# EAGLE design Debug (EAGLE 9.4.2)
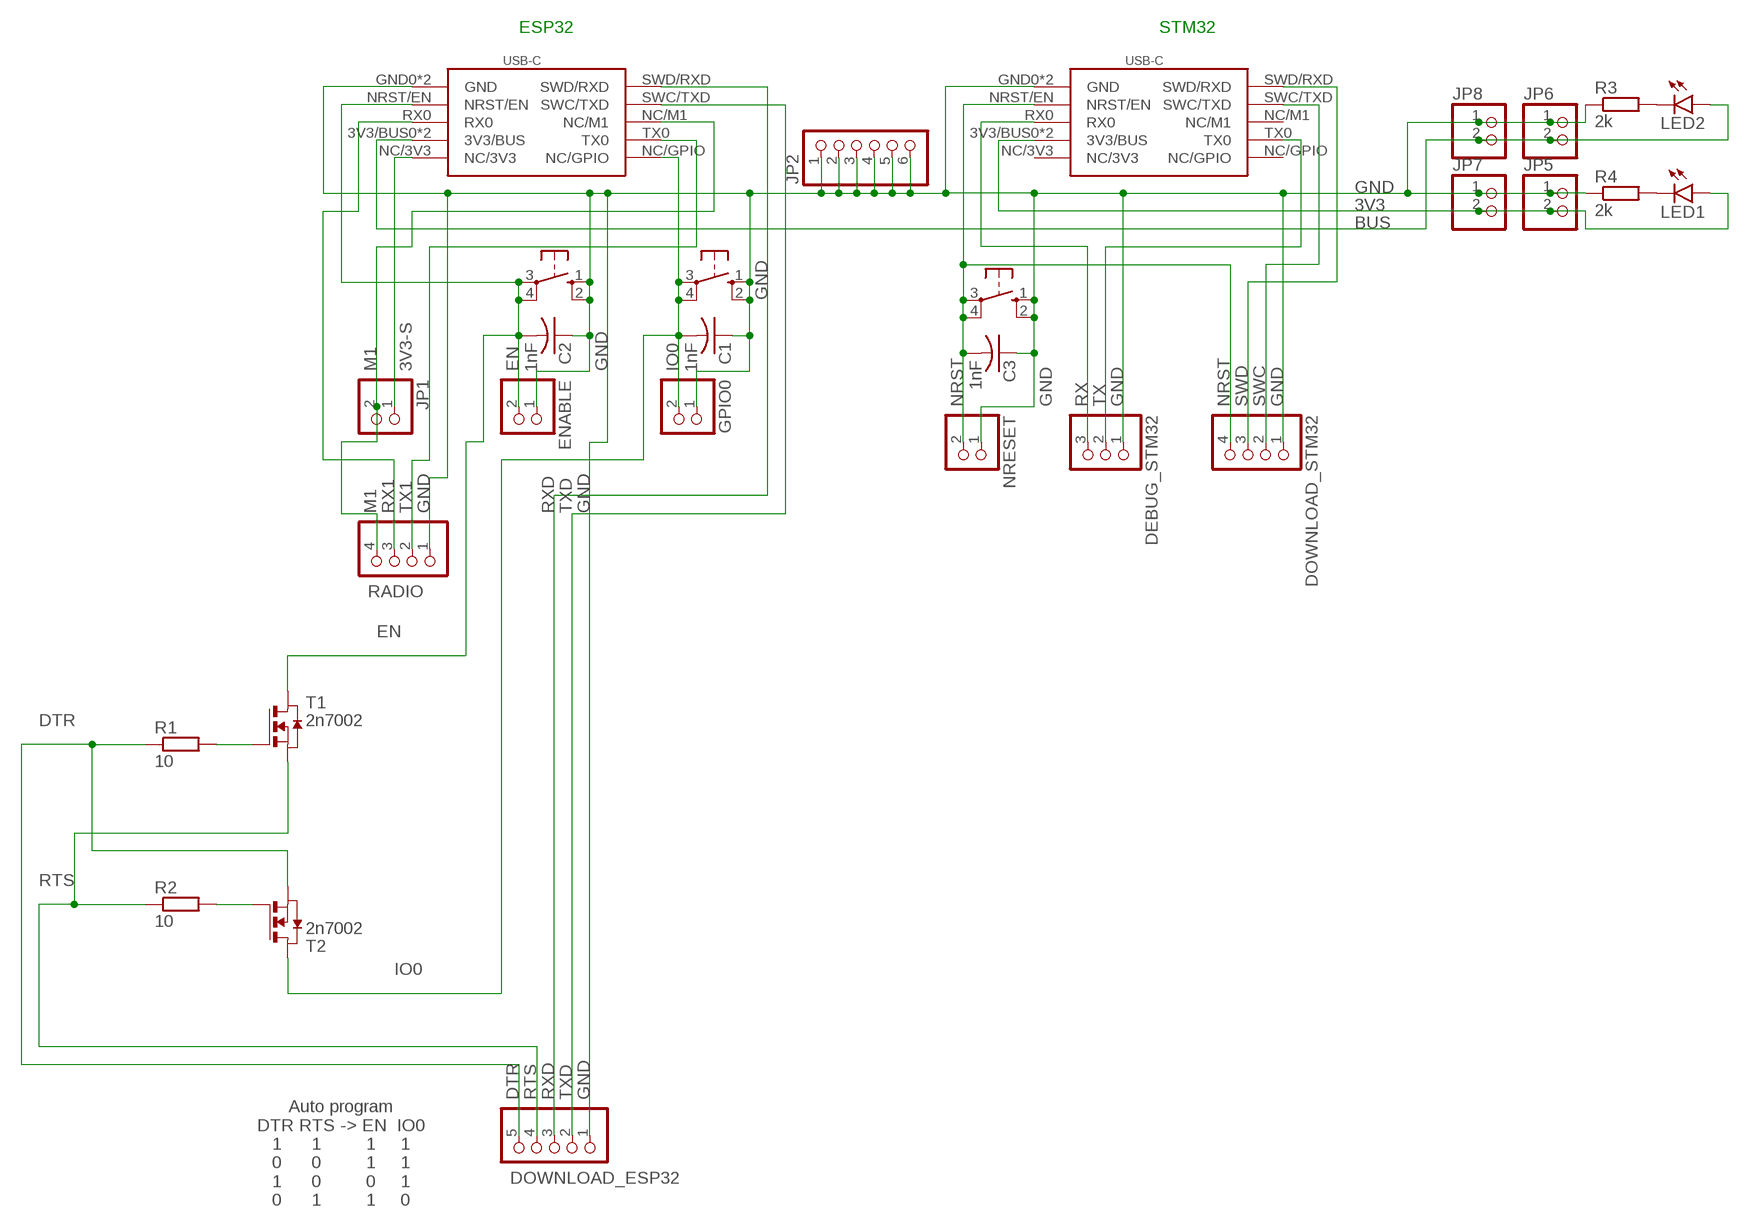
[diagram p0: schematic, sheet 1]

## Parts
C1  1nF  C-USC0603  [C0603]
C2  1nF  C-USC0603  [C0603]
C3  1nF  C-USC0603  [C0603]
DEBUG_STM32  PINHD-1X3  [1X03]
DOWNLOAD_ESP32  PINHD-1X5  [1X05]
DOWNLOAD_STM32  PINHD-1X4  [1X04]
EN  10-XX  [B3F-10XX]
ENABLE  PINHD-1X2  [1X02]
GPIO0  PINHD-1X2  [1X02]
IO0  10-XX  [B3F-10XX]
JP1  PINHD-1X2  [1X02]
JP2  PINHD-1X6  [1X06]
JP5  PINHD-1X2  [1X02]
JP6  PINHD-1X2  [1X02]
JP7  PINHD-1X2  [1X02]
JP8  PINHD-1X2  [1X02]
LED1  LEDCHIPLED_0603  [CHIPLED_0603]
LED2  LEDCHIPLED_0603  [CHIPLED_0603]
NRESET  PINHD-1X2  [1X02]
NRST  10-XX  [B3F-10XX]
R1  10  R-EU_R0603  [R0603]
R2  10  R-EU_R0603  [R0603]
R3  2k  R-EU_R0603  [R0603]
R4  2k  R-EU_R0603  [R0603]
RADIO  PINHD-1X4  [1X04]
T1  2n7002  NMOSSOT23  [SOT-23]
T2  2n7002  NMOSSOT23  [SOT-23]
U$1  USB-C  [USB-C]
U$2  USB-C  [USB-C]

## Nets
3V3: JP5.2 JP7.2 LED1.A U$2.3V3/BUS0(3V3/BUS) U$2.3V3/BUS1(3V3/BUS)
3V3-S: JP1.1 U$1.NC/3V3
BUS: JP6.2 JP8.2 LED2.A U$1.3V3/BUS0(3V3/BUS) U$1.3V3/BUS1(3V3/BUS)
DTR: DOWNLOAD_ESP32.5 R1.1 T2.2(S)
EN: C2.2 EN.3(P) EN.4(P1) ENABLE.2 T1.1(D) U$1.NRST/EN
GND: C1.1 C2.1 C3.1 DEBUG_STM32.1 DOWNLOAD_ESP32.1 DOWNLOAD_STM32.1 EN.1(S) EN.2(S1) ENABLE.1 GPIO0.1 IO0.1(S) IO0.2(S1) JP2.1 JP2.2 JP2.3 JP2.4 JP2.5 JP2.6 JP5.1 JP6.1 JP7.1 JP8.1 NRESET.1 NRST.1(S) NRST.2(S1) R3.1 R4.1 RADIO.1 U$1.GND0(GND) U$1.GND1(GND) U$2.GND0(GND) U$2.GND1(GND)
IO0: C1.2 GPIO0.2 IO0.3(P) IO0.4(P1) T2.1(D) U$1.NC/GPIO
M1: JP1.2 RADIO.4 U$1.NC/M1
N$1: R2.2 T2.3(G)
N$2: R1.2 T1.3(G)
N$3: LED1.C R4.2
N$4: LED2.C R3.2
NRST: C3.2 DOWNLOAD_STM32.4 NRESET.2 NRST.3(P) NRST.4(P1) U$2.NRST/EN
RTS: DOWNLOAD_ESP32.4 R2.1 T1.2(S)
RX: DEBUG_STM32.3 U$2.RX0
RX1: RADIO.3 U$1.RX0
RXD: DOWNLOAD_ESP32.3 U$1.SWD/RXD
SWC: DOWNLOAD_STM32.2 U$2.SWC/TXD
SWD: DOWNLOAD_STM32.3 U$2.SWD/RXD
TX: DEBUG_STM32.2 U$2.TX0
TX1: RADIO.2 U$1.TX0
TXD: DOWNLOAD_ESP32.2 U$1.SWC/TXD
Unconnected: U$2.NC/3V3 U$2.NC/GPIO U$2.NC/M1

## Notes on the sheet
- ESP32 | STM32
- Auto program
  DTR RTS -> EN  IO0
  1      1         1     1
  0      0         1     1
  1      0         0     1
  0      1         1     0

## Library data of the parts
C1-C3 = rcl:C-US: CAPACITOR, American symbol; SPICEPREFIX: C
DEBUG_STM32 = pinhead:PINHD-1X3: PIN HEADER
DOWNLOAD_ESP32 = pinhead:PINHD-1X5: PIN HEADER
DOWNLOAD_STM32 RADIO = pinhead:PINHD-1X4: PIN HEADER
EN IO0 NRST = switch-omron:10-XX: OMRON SWITCH; MPN: B3F-1000; OC_FARNELL: 176432; OC_NEWARK: 36M3542
ENABLE GPIO0 JP1 JP5-JP8 NRESET = pinhead:PINHD-1X2: PIN HEADER
JP2 = pinhead:PINHD-1X6: PIN HEADER
LED1 LED2 = led:LED: LED OSRAM: - CHIPLED LG R971, LG N971, LY N971, LG Q971, LY Q971, LO R971, LY R971 LH N974, LH R974 LS Q976, LO Q976, LY Q976 LO Q996 - Hyper CHIPLED LW Q18S LB Q993, LB Q99A, LB R99A - SideLED LS A670, LO A670, LY A670, LG A670, LP A670 LB A673, LV A673, LT A673, LW A673 LH A674 LY A675 LS A676, LA A676, LO A676, LY A676, LW A676 LS A679, LY A679, LG A679 - Hyper Micro SIDELED® LS Y876, LA Y876, LO Y876, LY Y876 LT Y87S - SmartLED LW L88C, LW L88S LB L89C, LB L89S, LG L890 LS L89K, LO L89K, LY L89K LS L896, LA L896, LO L896, LY L896 - TOPLED LS T670, LO T670, LY T670, LG T670, LP T670 LSG T670, LSP T670, LSY T670, LOP T670, LYG T670 LG T671, LOG T671, LSG T671 LB T673, LV T673, LT T673, LW T673 LH T674 LS T676, LA T676, LO T676, LY T676, LB T676, LH T676, LSB T676, LW T676 LB T67C, LV T67C, LT T67C, LS T67K, LO T67K, LY T67K, LW E67C LS E67B, LA E67B, LO E67B, LY E67B, LB E67C, LV E67C, LT E67C LW T67C LS T679, LY T679, LG T679 LS T770, LO T770, LY T770, LG T770, LP T770 LB T773, LV T773, LT T773, LW T773 LH T774 LS E675, LA E675, LY E675, LS T675 LS T776, LA T776, LO T776, LY T776, LB T776 LHGB T686 LT T68C, LB T68C - Hyper Mini TOPLED® LB M676 - Mini TOPLED Santana® LG M470 LS M47K, LO M47K, LY M47K Source: http://www.osram.convergy.de LUXEON: - LUMILED® LXK2-PW12-R00, LXK2-PW12-S00, LXK2-PW14-U00, LXK2-PW14-V00 LXK2-PM12-R00, LXK2-PM12-S00, LXK2-PM14-U00 LXK2-PE12-Q00, LXK2-PE12-R00, LXK2-PE12-S00, LXK2-PE14-T00, LXK2-PE14-U00 LXK2-PB12-K00, LXK2-PB12-L00, LXK2-PB12-M00, LXK2-PB14-N00, LXK2-PB14-P00, LXK2-PB14-Q00 LXK2-PR12-L00, LXK2-PR12-M00, LXK2-PR14-Q00, LXK2-PR14-R00 LXK2-PD12-Q00, LXK2-PD12-R00, LXK2-PD12-S00 LXK2-PH12-R00, LXK2-PH12-S00 LXK2-PL12-P00, LXK2-PL12-Q00, LXK2-PL12-R00 Source: www.luxeon.com KINGBRIGHT: KA-3528ASYC Source: www.kingbright.com
R1-R4 = rcl:R-EU_: RESISTOR, European symbol; SPICEPREFIX: R
T1 T2 = zetex:NMOSSOT23: MOS FET; OC_FARNELL: unknown; OC_NEWARK: unknown
U$1 U$2 = CanCubeSat:USB-C

## Board
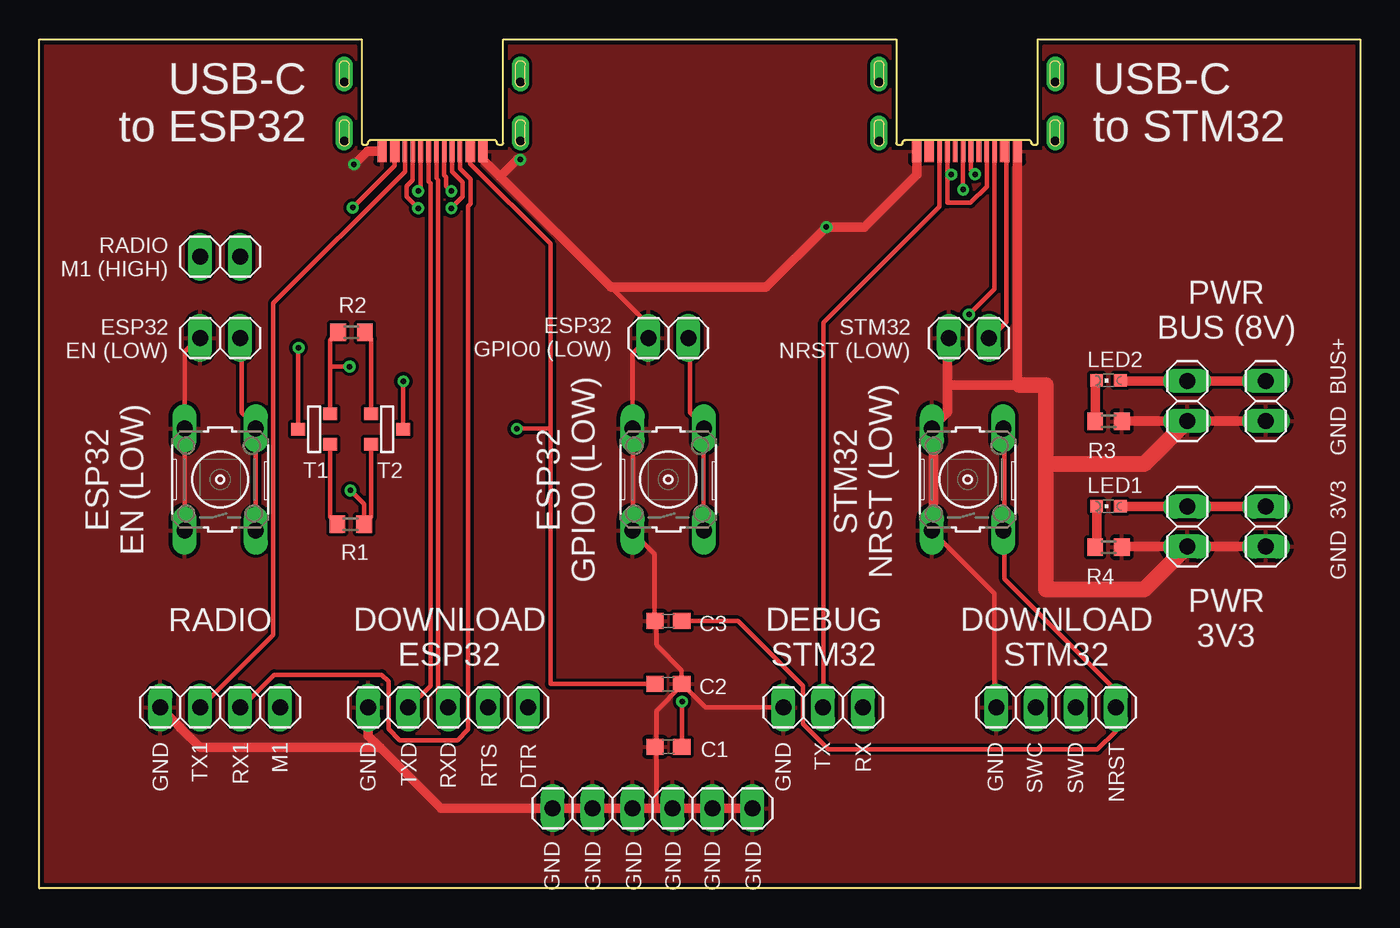
[diagram p1: board, top side]
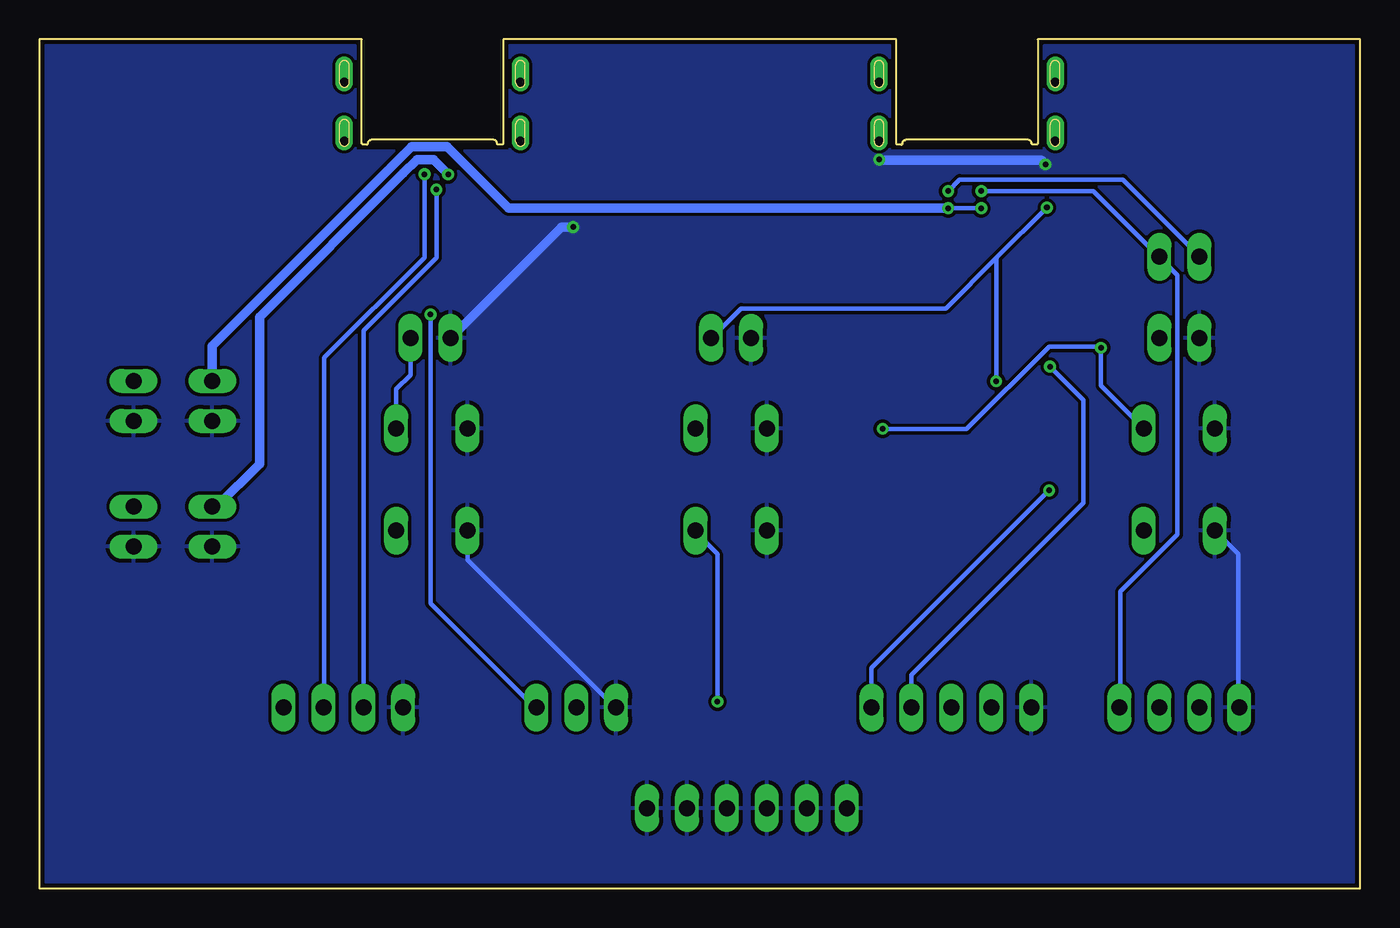
[diagram p2: board, bottom side, seen from below]

Size 84 x 54 mm. Coordinates in mm from the lower left corner, seen from the top.
Outline: 20.5,54 0,54 0,0 84,0 84,54 63.5,54
Outline: 29.5,54 54.5,54
Copper layers (1*16): Top 0.035mm / dielectric 1.5mm / Bottom 0.035mm
Design rules "default *": minimum track width 0.3mm, minimum drill 0.35mm, track to track 0.2mm, track to pad 0.2mm, pad to pad 0.2mm, via to via 0.2mm, smd to smd 0.2mm, copper to edge 0mil, drill to drill 6mil, minimum pad ring 10mil, minimum via ring 8mil, stop-mask expansion 4mil, vias tented up to drill 0mil, thermal gap 10mil

### Footprints (pad centres in the part's own frame; a part is rotated, then mirrored left to right if it is on the bottom)
C0603 = smd 1.1 x 1: 1 -0.85,0; 2 0.85,0
1X03 = drill 1.016 long: 1 -2.54,0; 2 0,0; 3 2.54,0
1X05 = drill 1.016 long: 1 -5.08,0; 2 -2.54,0; 3 0,0; 4 2.54,0; 5 5.08,0
1X04 = drill 1.016 long: 1 -3.81,0; 2 -1.27,0; 3 1.27,0; 4 3.81,0
B3F-10XX = drill 1.016 long: 1 -3.251,2.261; 2 3.251,2.261; 3 -3.251,-2.261; 4 3.251,-2.261
1X02 = drill 1.016 long: 1 -1.27,0; 2 1.27,0
1X06 = drill 1.016 long: 1 -6.35,0; 2 -3.81,0; 3 -1.27,0; 4 1.27,0; 5 3.81,0; 6 6.35,0
CHIPLED_0603 = smd 0.8 x 0.8: A 0,-0.75; C 0,0.75
R0603 = smd 1 x 1.1: 1 -0.85,0; 2 0.85,0
SOT-23 = smd 0.787 x 0.889: 1 0.025,-1.016; 2 -0.94,1.016; 3 0.991,1.016
USB-C = smd 0.3 x 1.4: 3V3/BUS0 -1.25,7.1; 3V3/BUS1 1.25,7.1; NC/3V3 -0.75,7.1; NC/M1 0.75,7.1; RX0 -1.75,7.1; SWC/TXD 0.25,7.1; SWD/RXD -0.25,7.1; TX0 1.75,7.1 | smd 0.6 x 1.4: GND0 -3.2,7.1; GND1 3.2,7.1; NC/GPIO 2.4,7.1; NRST/EN -2.4,7.1 | drill 0.6 pad 1.1 offset: P$13 -5.6,6.5; P$14 -5.6,2.75; P$15 5.6,6.5; P$16 5.6,2.75

### Placement (x,y rotation side)
C1  40,9 0 top
C2  40,13 180 top
C3  40,17 0 top
DEBUG_STM32  49.85,11.5 0 top
DOWNLOAD_ESP32  26,11.5 0 top
DOWNLOAD_STM32  64.66,11.5 0 top
EN  11.5,26 90 top
ENABLE  11.5,35 0 top
GPIO0  40,35 0 top
IO0  40,26 90 top
JP1  11.5,40.17 0 top
JP2  39,5.09 0 top
JP5  73,23 90 top
JP6  73,31 90 top
JP7  78,23 90 top
JP8  78,31 90 top
LED1  68,24.3 90 top
LED2  68,32.3 90 top
NRESET  59.12,35 0 top
NRST  59.04,26 90 top
R1  19.8,23.16 180 top
R2  19.85,35.36 0 top
R3  68,29.7 180 top
R4  68,21.7 180 top
RADIO  11.5,11.5 0 top
T1  17.49,29.23 270 top
T2  22.12,29.18 90 top
U$1  25,54 180 top
U$2  59,54 180 top

### Tracks (layer width: path | path; a pad name or v marks a point on that pad's centre or on a via)
3V3  (via drill 0.35)
  Top 0.3: U$2.3V3/BUS1 57.75,45.41 | 57.75,45.41 57.75,43.6 59.23,43.6 60.25,44.62 U$2.3V3/BUS0 | v58,45.41 57.75,45.41
  Top 0.6: JP7.2 JP5.2 68.78,24.27 LED1.A
  Bottom 0.6: JP5.2 72.73,24.27 70,27 70,36.34 60.87,45.47 59.98,46.36 58.93,46.36 v58,45.41
3V3-S  (via drill 0.35)
  Top 0.3: v26.2,44.35 25.88,44.67 25.88,45.25 25.75,45.37 U$1.NC/3V3
  Bottom 0.3: JP1.1 10.25,40.25 15.08,45.08 25.47,45.08 v26.2,44.35
BUS  (via drill 0.35)
  Top 0.3: v24.1,43.25 23.37,43.98 23.37,44.65 23.75,45.03 U$1.3V3/BUS1 | U$1.3V3/BUS0 26.25,45.58 26.93,44.9 26.93,43.98 v26.2,43.25
  Top 0.6: JP8.2 JP6.2 68.78,32.27 LED2.A
  Bottom 0.3: v26.2,43.25 v24.1,43.25
  Bottom 0.6: JP6.2 73,34.48 60.32,47.16 59.6,47.16 59.26,47.16 59.25,47.16 58.93,47.16 58.05,47.16 54.15,43.25 v26.2,43.25
DTR  (via drill 0.35)
  Top 0.3: T2.2 21.1,23.61 R1.1 20.65,24.44 v19.79,25.3
  Bottom 0.3: v19.79,25.3 31.08,14.01 DOWNLOAD_ESP32.5
EN  (via drill 0.35)
  Top 0.3: EN.3 EN.4 13.75,29.38 12.88,30.25 12.88,35 ENABLE.2 | 32.5,29.23 32.5,13 C2.2 | T1.1 v16.47,34.37 v16.48,34.38 | v30.36,29.23 v30.37,29.23 32.5,29.23 | 32.5,29.23 32.5,41 27.4,46.1 U$1.NRST/EN
  Bottom 0.3: EN.4 16.48,31.97 v16.48,34.38 16.55,34.45 19.78,34.45 25.03,29.2 30.34,29.2 v30.36,29.23
GND  (via drill 0.35)
  Top 0.3: 56.88,22.75 NRST.1 56.88,22.62 60.75,18.75 60.75,11.5 DOWNLOAD_STM32.1 | 56.88,29.25 NRST.2 56.88,29.38 | 57.75,35 NRESET.1 | EN.1 EN.2 9.25,29.38 9.25,34.12 10.12,35 ENABLE.1 | 39.25,9 39.25,11.3 40.85,12.9 C2.1 | 39.25,9 C1.1 | C2.1 40.85,13.88 39.25,15.47 39.25,17 C3.1 39.12,17 39.12,21.25 37.75,22.62 IO0.1 IO0.2 37.74,34.01 GPIO0.1 38.73,35.84 36.35,38.23 | DEBUG_STM32.1 42.38,11.5 40.88,13 C2.1 | 39.25,9 39.25,5.24 39.1,5.09
  Top 0.6: 56.88,29.25 56.88,22.75 | 57.75,32 57.75,30.25 56.88,29.38 | 57.75,32 57.75,35 | 29.31,45.27 36.35,38.23 46.22,38.23 v50.05,42.06 52.46,42.06 55.8,45.4 U$2.GND1 | v30.59,46.35 30.39,46.35 29.31,45.27 | JP8.1 JP6.1 68.88,29.73 R3.1 | JP7.1 JP5.1 68.88,21.73 R4.1 | U$1.GND1 20.87,46.9 v20.01,46.04 | 29.31,45.27 28.2,46.38 U$1.GND0 | JP2.6 JP2.5 JP2.4 39.1,5.09 JP2.3 JP2.2 JP2.1 25.54,5.09 21.66,8.96 | 21.66,8.96 20.92,9.71 DOWNLOAD_ESP32.1 | RADIO.1 8.97,10.22 8.97,10.21 10.22,8.96 21.66,8.96 | U$2.GND0 62.2,32.12 | 62.2,32.12 62.32,32 | 62.2,32.12 62.08,32 57.75,32
  Top 1: 62.32,32 64,32 64,27 | 64,27 64,19 70.27,19 JP5.1 | JP6.1 70.27,27 64,27
  Bottom 0.3: RADIO.1 7.75,11.5 7.75,21.25 9.12,22.62 EN.1 | NRST.1 56.75,22.62 56.75,20.88 47.38,11.5 DEBUG_STM32.1
  Bottom 0.6: v20.01,46.04 20.29,46.32 30.56,46.32 v30.59,46.35 | v50.05,42.06 50.79,42.06 NRESET.1
  pour Top: 0.4,53.6 20.1,53.6 20.1,46.9 29.9,46.9 29.9,53.6 54.1,53.6 54.1,46.9 63.9,46.9 63.9,53.6 83.6,53.6 83.6,0.4 0.4,0.4
  pour Bottom: 0.4,53.6 20.1,53.6 20.1,46.9 29.9,46.9 29.9,53.6 54.1,53.6 54.1,46.9 63.9,46.9 63.9,53.6 83.6,53.6 83.6,0.4 0.4,0.4
IO0  (via drill 0.35)
  Top 0.3: v40.88,11.88 40.88,9 C1.2 | IO0.3 IO0.4 42.25,29.38 41.38,30.25 41.38,35 GPIO0.2 | v23.15,32.25 T2.1 | U$1.NC/GPIO 22.6,45.98 v19.93,43.3
  Bottom 0.3: GPIO0.2 41.25,35 39.38,36.88 26.35,36.88 23.12,40.1 | v40.88,11.88 40.88,21.25 42.25,22.62 IO0.3 | v19.93,43.3 23.12,40.1 | 23.12,40.1 23.12,32.25 v23.15,32.25
M1  (via drill 0.35)
  Top 0.3: U$1.NC/M1 24.25,44.5 v24.1,44.35
  Bottom 0.3: v24.1,44.35 16.98,44.35 12.88,40.25 JP1.2 12.75,40.12 11.62,39 11.62,22.5 15.25,18.88 15.25,11.5 RADIO.4
N$1
  Top 0.3: T2.3 21.1,34.96 R2.2
N$2
  Top 0.3: T1.3 18.51,23.6 R1.2
N$3
  Top 0.6: LED1.C 67.25,21.8 R4.2
N$4
  Top 0.6: R3.2 67.15,32.2 LED2.C
NRST
  Top 0.3: NRST.4 61.38,29.25 61.38,22.75 NRST.3 61.38,22.62 61.38,19.68 68.47,12.58 DOWNLOAD_STM32.4 68.47,9.99 67.3,8.82 50.17,8.82 48.55,10.45 48.55,12.88 44.42,17 C3.2 | U$2.NRST/EN 61.5,46.88 61.5,36 60.5,35 NRESET.2
  Bottom 0.3: NRESET.2 60.39,32.66 61.3,31.75 NRST.4
RTS  (via drill 0.35)
  Top 0.3: T1.2 18.51,33.18 | 18.51,33.18 18.51,34.87 R2.1 | v19.73,33.18 18.51,33.18
  Bottom 0.3: DOWNLOAD_ESP32.4 28.54,13.57 17.6,24.51 17.6,31.05 v19.73,33.18
RX  (via drill 0.35)
  Top 0.3: U$2.RX0 60.75,38.12 v59.12,36.5
  Bottom 0.3: v59.12,36.5 59.12,18.12 52.5,11.5 DEBUG_STM32.3
RX1
  Top 0.3: RADIO.3 12.88,11.5 14.95,13.57 21.77,13.57 22.2,13.15 22.2,10.12 22.9,9.43 26.6,9.43 27.27,10.1 27.27,43.4 27.44,43.56 27.44,45.1 26.75,45.79 U$1.RX0
RXD
  Top 0.3: DOWNLOAD_ESP32.3 25.38,12.12 25.38,45.04 25.37,45.04 25.25,45.16 U$1.SWD/RXD
SWC  (via drill 0.35)
  Top 0.3: v58.75,44.44 U$2.SWC/TXD
  Bottom 0.3: DOWNLOAD_STM32.2 63.38,11.5 63.38,35.48 58.75,40.1 v58.75,44.44
SWD  (via drill 0.35)
  Top 0.3: U$2.SWD/RXD 59.25,45.67 v59.5,45.42
  Bottom 0.3: DOWNLOAD_STM32.3 65.88,11.5 65.88,33.75 59.5,40.12 v59.5,45.42
TX
  Top 0.3: DEBUG_STM32.2 49.88,11.5 49.88,35.98 57.25,43.35 U$2.TX0
TX1
  Top 0.3: RADIO.2 10.25,11.5 14.88,16.12 14.88,37.22 23.25,45.59 U$1.TX0
TXD
  Top 0.3: DOWNLOAD_ESP32.2 23.5,11.5 24.88,12.88 24.88,44.83 24.87,44.84 24.75,44.96 U$1.SWC/TXD

### Text on the board
tNames: USB-C / to ESP32 | USB-C / to STM32 | RADIO / M1 (HIGH) | PWR / BUS (8V) | ESP32 / EN (LOW) | ESP32 / GPIO0 (LOW) | STM32 / NRST (LOW) | BUS+ | GND | ESP32 / EN (LOW) | ESP32 / GPIO0 (LOW) | STM32 / NRST (LOW) | 3V3 | GND | RADIO | PWR / 3V3 | DOWNLOAD / ESP32 | DEBUG / STM32 | DOWNLOAD / STM32 | GND | TX1 | RX1 | M1 | GND | TXD | RXD | RTS | DTR | GND | TX | RX | GND | SWC | SWD | NRST | GND | GND | GND | GND | GND | GND